# EAGLE design PCB 1e (EAGLE 9.3.1)
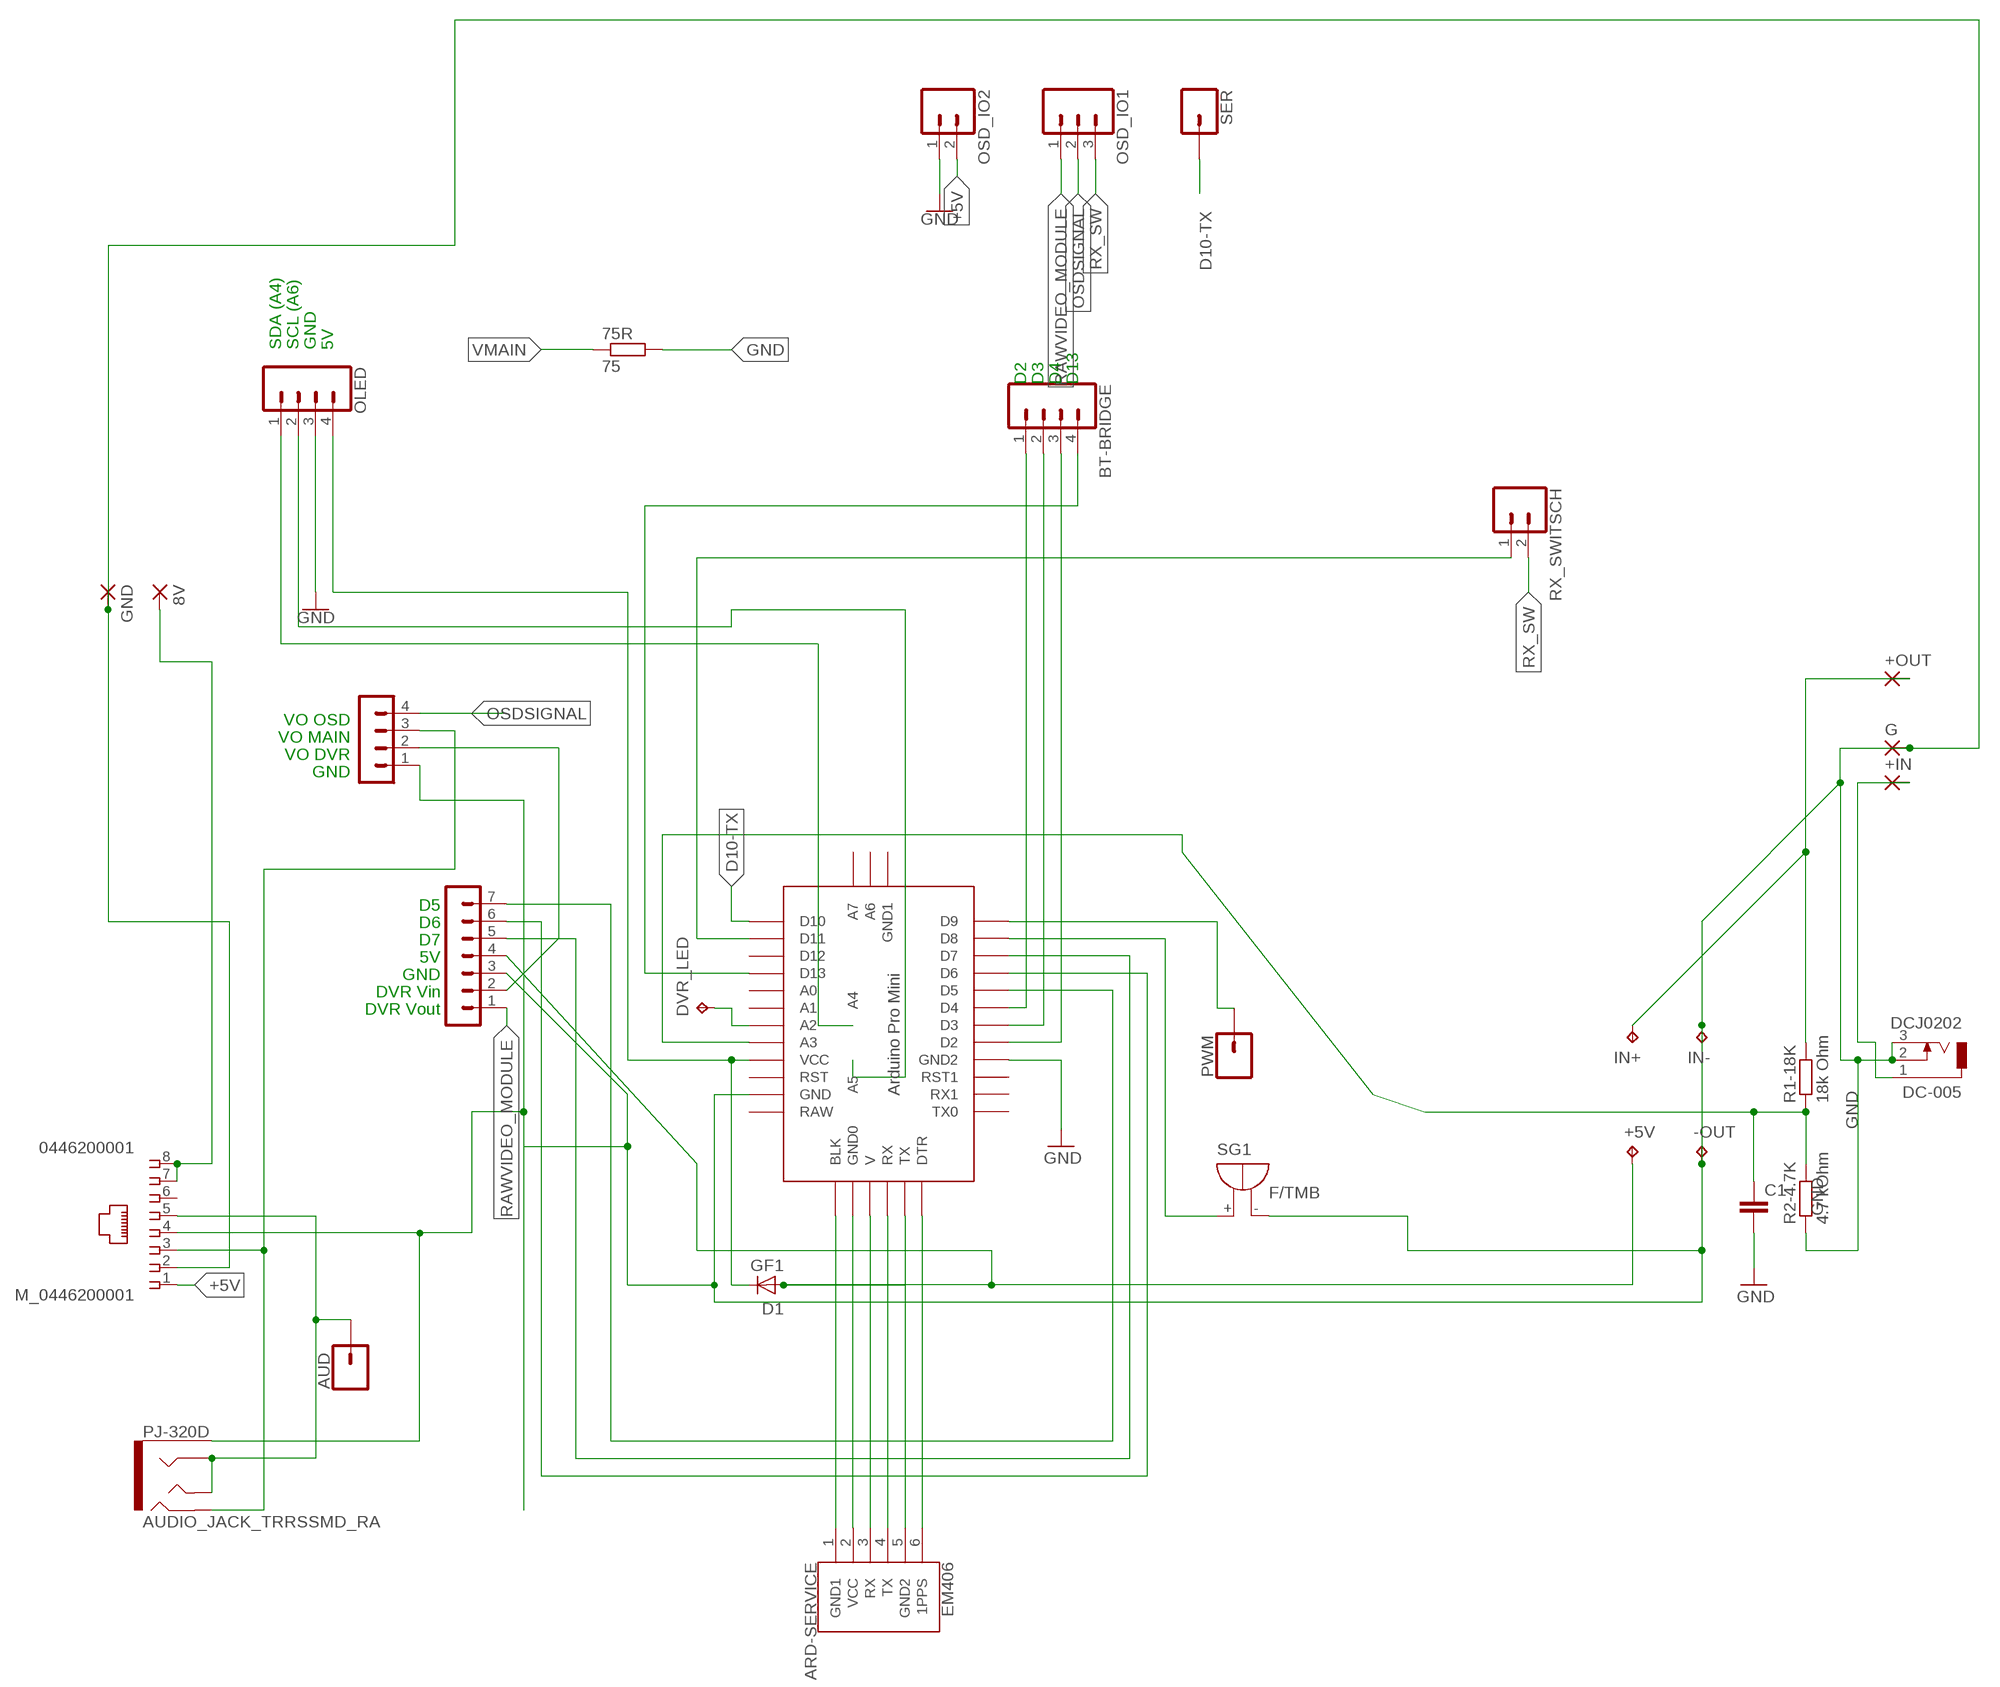
[diagram p0: schematic, sheet 1]

## Parts
8V  2,54/1,1  [2,54/1,1]
75R  75  R-EU_R0603  [R0603]
+5V  TPTP20SQ  [TP20SQ]
+IN  2,54/1,1  [2,54/1,1]
+OUT  2,54/1,1  [2,54/1,1]
-OUT  TPTP20SQ  [TP20SQ]
ARD-SERVICE  EM406  [1X06-1MM]
AUD  CONN_01  [1X01]
BT-BRIDGE  CONN_04  [1X04]
C1  C-EUC1206K  [C1206K]
D1  GF1  [SMA-DO214AC]
DC-005  DCJ0202  [DCJ0202]
DVR_LED  TPTP20SQ  [TP20SQ]
G  2,54/1,1  [2,54/1,1]
GND  2,54/1,1  [2,54/1,1]
IN+  TPTP20SQ  [TP20SQ]
IN-  TPTP20SQ  [TP20SQ]
M_0446200001  0446200001  [0446200001]
MODULE-IO  MA07-1  [MA07-1]
OLED  CONN_04  [1X04]
OSD_IO1  CONN_03  [1X03]
OSD_IO2  CONN_02  [1X02]
PJ-320D  AUDIO_JACK_TRRSSMD_RA  [AUDIO_JACK_3.5MM_TRRS_SMD_RA]
PWM  CONN_01  [1X01]
R1-18K  18k Ohm  R-EU_M1206  [M1206]
R2-4.7K  4.7 kOhm  R-EU_M1206  [M1206]
RX_SWITSCH  CONN_02  [1X02]
SER  CONN_01  [1X01]
SG1  F/TMB  [F/TMB]
U$1  ABK-PRO-MINI  [ABK-PRO-MINI]
V-IO  MA04-1  [MA04-1]

## Nets
5VPROTECTED: D1.K(C) OLED.4 U$1.VCC
8V: 8V.1(P) M_0446200001.7 M_0446200001.8
+: +IN.1(P) DC-005.1
+5V: +5V.TP D1.A M_0446200001.1 MODULE-IO.4 OSD_IO2.2
AUDIO [thin]: AUD.1 M_0446200001.5 PJ-320D.RING1 PJ-320D.TIP
BUTTON1 [thin]: BT-BRIDGE.3 U$1.D2
BUTTON2 [thin]: BT-BRIDGE.2 U$1.D3
BUTTON3 [thin]: BT-BRIDGE.1 U$1.D4
BUZZER [thin]: SG1.+ U$1.D8
D5 [thin]: MODULE-IO.7 U$1.D5
D6 [thin]: MODULE-IO.6 U$1.D6
D7 [thin]: MODULE-IO.5 U$1.D7
D9PWM [thin]: PWM.1 U$1.D9
D10-TX [thin]: SER.1 U$1.D10
D11-RX [thin]: RX_SWITSCH.1 U$1.D11
DVRVIDEO-IN [medium]: MODULE-IO.2 V-IO.2
GND [d_cl]: 75R.2 -OUT.TP C1.2 DC-005.2 DC-005.3 G.1(P) GND.1(P) IN-.TP M_0446200001.2 M_0446200001.4 MODULE-IO.3 OLED.3 OSD_IO2.1 PJ-320D.EARTH R2-4.7K.1 SG1.- U$1.GND U$1.GND1(GND2) V-IO.1
LED [thin]: BT-BRIDGE.4 U$1.D13
N$1 [thin]: DVR_LED.TP U$1.A1(A2)
N$16 [thin]: ARD-SERVICE.1(GND1) U$1.BLK
N$18 [thin]: ARD-SERVICE.2(VCC) U$1.G(GND0)
N$19 [thin]: ARD-SERVICE.3(RX) U$1.5V(V)
N$21 [thin]: ARD-SERVICE.5(GND2) U$1.TX01(TX)
N$22 [thin]: ARD-SERVICE.6(1PPS) U$1.DTR
OSDSIGNAL [medium]: OSD_IO1.2 V-IO.4
RAWVIDEO_MODULE [medium]: MODULE-IO.1 OSD_IO1.1
RX_SW [thin]: OSD_IO1.3 RX_SWITSCH.2
SCL [thin]: OLED.2 U$1.A5
SDA [thin]: OLED.1 U$1.A4
V [thin]: ARD-SERVICE.4(TX) U$1.RX01(RX)
VCC: +OUT.1(P) IN+.TP R1-18K.2
VMAIN [medium]: 75R.1 M_0446200001.3 PJ-320D.RING2 V-IO.3
VSENS: C1.1 R1-18K.1 R2-4.7K.2 U$1.A0(A3)
Unconnected: M_0446200001.6 U$1.A2(A1) U$1.A3(A0) U$1.A6 U$1.A7 U$1.D12 U$1.GND4(GND1) U$1.RAW U$1.RST U$1.RST1 U$1.RX1 U$1.TX0

## Notes on the sheet
- SDA (A4) | SCL (A6) | GND | 5V
- D2 | D3 | D4 | D13
- VO OSD
- VO MAIN
- VO DVR
- GND
- D5
- D6
- D7
- 5V
- GND
- DVR Vin
- DVR Vout

## Library data of the parts
8V +IN +OUT G GND = wirepad:2,54/1,1: THROUGH-HOLE PAD
75R = resistor:R-EU_: RESISTOR, European symbol
+5V -OUT DVR_LED IN+ IN- = testpad:TP: Test pad
ARD-SERVICE = SparkFun-Connectors:EM406: EM406 GPS Connector Here is a six pin vertical 1.0mm pitch connector. It is useful if you need something very tiny as a connection. These are not the standard JST type connectors we use on most of our boards, but are actually the much smaller JST-SH type. Here is the connector we sell at SparkFun: JST SH Vertical 6-Pin Connector - SMD <https://www.sparkfun.com/products/579> (GPS-00579) Datasheet <http://www.sparkfun.com/datasheets/GPS/EM406-SMDConnector-eSH.pdf> It was used on these SparkFun products: SparkFun GPS Breakout <https://www.sparkfun.com/products/11818> (BOB-11818) SparkFun Weather Shield <https://www.sparkfun.com/products/12081> (DEV-12081) And many, many other GPS related products.; PROD_ID: CONN-08249; SF_ID: GPS-00579
AUD PWM SER = SparkFun-Connectors:CONN_01: Single connection point. Often used as Generic Header-pin footprint for 0.1 inch spaced/style header connections On any of the 0.1 inch spaced packages, you can populate with these: Break Away Headers - Straight <https://www.sparkfun.com/products/116> (PRT-00116) Break Away Male Headers - Right Angle <https://www.sparkfun.com/products/553> (PRT-00553) Female Headers <https://www.sparkfun.com/products/115> (PRT-00115) Break Away Headers - Machine Pin <https://www.sparkfun.com/products/117> (PRT-00117) Break Away Female Headers - Swiss Machine Pin <https://www.sparkfun.com/products/743> (PRT-00743) This device is also useful as a general connection point to wire up your design to another part of your project. Our various solder wires solder well into these plated through hole pads. Hook-Up Wire - Assortment (Stranded, 22 AWG) <https://www.sparkfun.com/products/11375> (PRT-11375) Hook-Up Wire - Assortment (Solid Core, 22 AWG) <https://www.sparkfun.com/products/11367> (PRT-11367) View the entire wire category on our website here <https://www.sparkfun.com/categories/141> Special notes: SMTSO-256-ET is a "flush mount" nut for a 4-40 screw. We mostly use this on specialty testbeds; it is a nice way to connect hardware to your PCB at an adjustable hieght. Also note, the SNAP packages are for using a snappable style connector. We sell a baggie of snaps and they are also used on two LilyPad designs: Snap Assortment - 30 pack (male and female) <https://www.sparkfun.com/products/11347> (DEV-11347) LilyPad Arduino SimpleSnap <https://www.sparkfun.com/products/10941> (DEV-10941) LilyPad SimpleSnap Protoboard <https://www.sparkfun.com/products/10940> (DEV-10940)
BT-BRIDGE OLED = SparkFun-Connectors:CONN_04: Multi connection point. Often used as Generic Header-pin footprint for 0.1 inch spaced/style header connections On any of the 0.1 inch spaced packages, you can populate with these: Break Away Headers - Straight <https://www.sparkfun.com/products/116> (PRT-00116) Break Away Male Headers - Right Angle <https://www.sparkfun.com/products/553> (PRT-00553) Female Headers <https://www.sparkfun.com/products/115> (PRT-00115) Break Away Headers - Machine Pin <https://www.sparkfun.com/products/117> (PRT-00117) Break Away Female Headers - Swiss Machine Pin <https://www.sparkfun.com/products/743> (PRT-00743) For SCREWTERMINALS and SPRING TERMINALS visit here: Screw Terimnals on SparkFun.com <https://www.sparkfun.com/search/results?term=Screw+Terminals> (5mm/3.5mm/2.54mm spacing) This device is also useful as a general connection point to wire up your design to another part of your project. Our various solder wires solder well into these plated through hole pads. Hook-Up Wire - Assortment (Stranded, 22 AWG) <https://www.sparkfun.com/products/11375> (PRT-11375) Hook-Up Wire - Assortment (Solid Core, 22 AWG) <https://www.sparkfun.com/products/11367> (PRT-11367) View the entire wire category on our website here <https://www.sparkfun.com/categories/141> Special notes: Molex polarized connector foot print use with SKU : PRT-08231 with associated crimp pins and housings. 1MM SMD Version SKU: PRT-10208; PROD_ID: CONN-09696
C1 = rcl:C-EU: CAPACITOR, European symbol; SPICEPREFIX: C
D1 = diode:GF1: DIODE
DC-005 = con-jack:DCJ0202: DC POWER JACK Source: DCJ0202.pdf; OC_FARNELL: unknown; OC_NEWARK: unknown
M_0446200001 = con-molex:0446200001: RJ-45 INVERTED MODULAR JACK ASSEMBLY WITH RJ-11 KEEPOUT FEATURE Source: Data sheet <http://www.farnell.com/datasheets/73207.pdf>; MF: MOLEX; OC_FARNELL: unknown
MODULE-IO = con-lstb:MA07-1: PIN HEADER; OC_FARNELL: unknown; OC_NEWARK: unknown
OSD_IO1 = SparkFun-Connectors:CONN_03: Multi connection point. Often used as Generic Header-pin footprint for 0.1 inch spaced/style header connections On any of the 0.1 inch spaced packages, you can populate with these: Break Away Headers - Straight <https://www.sparkfun.com/products/116> (PRT-00116) Break Away Male Headers - Right Angle <https://www.sparkfun.com/products/553> (PRT-00553) Female Headers <https://www.sparkfun.com/products/115> (PRT-00115) Break Away Headers - Machine Pin <https://www.sparkfun.com/products/117> (PRT-00117) Break Away Female Headers - Swiss Machine Pin <https://www.sparkfun.com/products/743> (PRT-00743) Stackable Header - 3 Pin (Female, 0.1") <https://www.sparkfun.com/products/13875> (PRT-13875) For SCREWTERMINALS and SPRING TERMINALS visit here: Screw Terimnals on SparkFun.com <https://www.sparkfun.com/search/results?term=Screw+Terminals> (5mm/3.5mm/2.54mm spacing) This device is also useful as a general connection point to wire up your design to another part of your project. Our various solder wires solder well into these plated through hole pads. Hook-Up Wire - Assortment (Stranded, 22 AWG) <https://www.sparkfun.com/products/11375> (PRT-11375) Hook-Up Wire - Assortment (Solid Core, 22 AWG) <https://www.sparkfun.com/products/11367> (PRT-11367) View the entire wire category on our website here <https://www.sparkfun.com/categories/141> Special notes: Molex polarized connector foot print use with SKU : PRT-08232 with associated crimp pins and housings.
OSD_IO2 RX_SWITSCH = SparkFun-Connectors:CONN_02: Multi connection point. Often used as Generic Header-pin footprint for 0.1 inch spaced/style header connections On any of the 0.1 inch spaced packages, you can populate with these: Break Away Headers - Straight <https://www.sparkfun.com/products/116> (PRT-00116) Break Away Male Headers - Right Angle <https://www.sparkfun.com/products/553> (PRT-00553) Female Headers <https://www.sparkfun.com/products/115> (PRT-00115) Break Away Headers - Machine Pin <https://www.sparkfun.com/products/117> (PRT-00117) Break Away Female Headers - Swiss Machine Pin <https://www.sparkfun.com/products/743> (PRT-00743) For SCREWTERMINALS and SPRING TERMINALS visit here: Screw Terimnals on SparkFun.com <https://www.sparkfun.com/search/results?term=Screw+Terminals> (5mm/3.5mm/2.54mm spacing) This device is also useful as a general connection point to wire up your design to another part of your project. Our various solder wires solder well into these plated through hole pads. Hook-Up Wire - Assortment (Stranded, 22 AWG) <https://www.sparkfun.com/products/11375> (PRT-11375) Hook-Up Wire - Assortment (Solid Core, 22 AWG) <https://www.sparkfun.com/products/11367> (PRT-11367) View the entire wire category on our website here <https://www.sparkfun.com/categories/141> Special notes: Molex polarized connector foot print use with: PRT-08233 with associated crimp pins and housings. 2.54_SCREWTERM for use with PRT-10571. 3.5mm Screw Terminal footprints for PRT-08084 5mm Screw Terminal footprints for use with PRT-08432
PJ-320D = SparkFun-Connectors:AUDIO_JACK_TRRS: Audio Jack - 3.5mm TRRS (SMD) This is a 3.5mm TRRS SMD audio jack. TRRS connectors are the audio-style connectors that you see on some phones, MP3 players and development boards. TRRS stands for “tip, ring, ring, sleeve,” which reflects that this has three conductors and a ground. SparkFun Products: Audio Jack <https://www.sparkfun.com/products/12639> mbed Starter Kit <https://www.sparkfun.com/products/12968> SparkFun TRRS 3.5mm Jack Breakout <https://www.sparkfun.com/products/11570>; PROD_ID: CONN-10676; SF_ID: PRT-12639
R1-18K R2-4.7K = rcl:R-EU_: RESISTOR, European symbol; SPICEPREFIX: R
SG1 = buzzer:F/TMB: BUZZER Source: Buerklin; OC_FARNELL: unknown; OC_NEWARK: unknown
U$1 = Arduino-clone:ABK-PRO-MINI: ABK Pro-Mini Arduino Clone
V-IO = con-lstb:MA04-1: PIN HEADER; OC_FARNELL: unknown; OC_NEWARK: unknown

## Net classes
0 default: width 0.762 mm, drill 0.508 mm, clearance 0.508 mm
1 thin: width 0.3 mm, drill 0.3 mm, clearance 0.3 mm
2 medium: width 0.5 mm, drill 0.4 mm, clearance 0.3 mm
3 d_cl: width 0.762 mm, drill 0.508 mm, clearance 0.3 mm

## Board
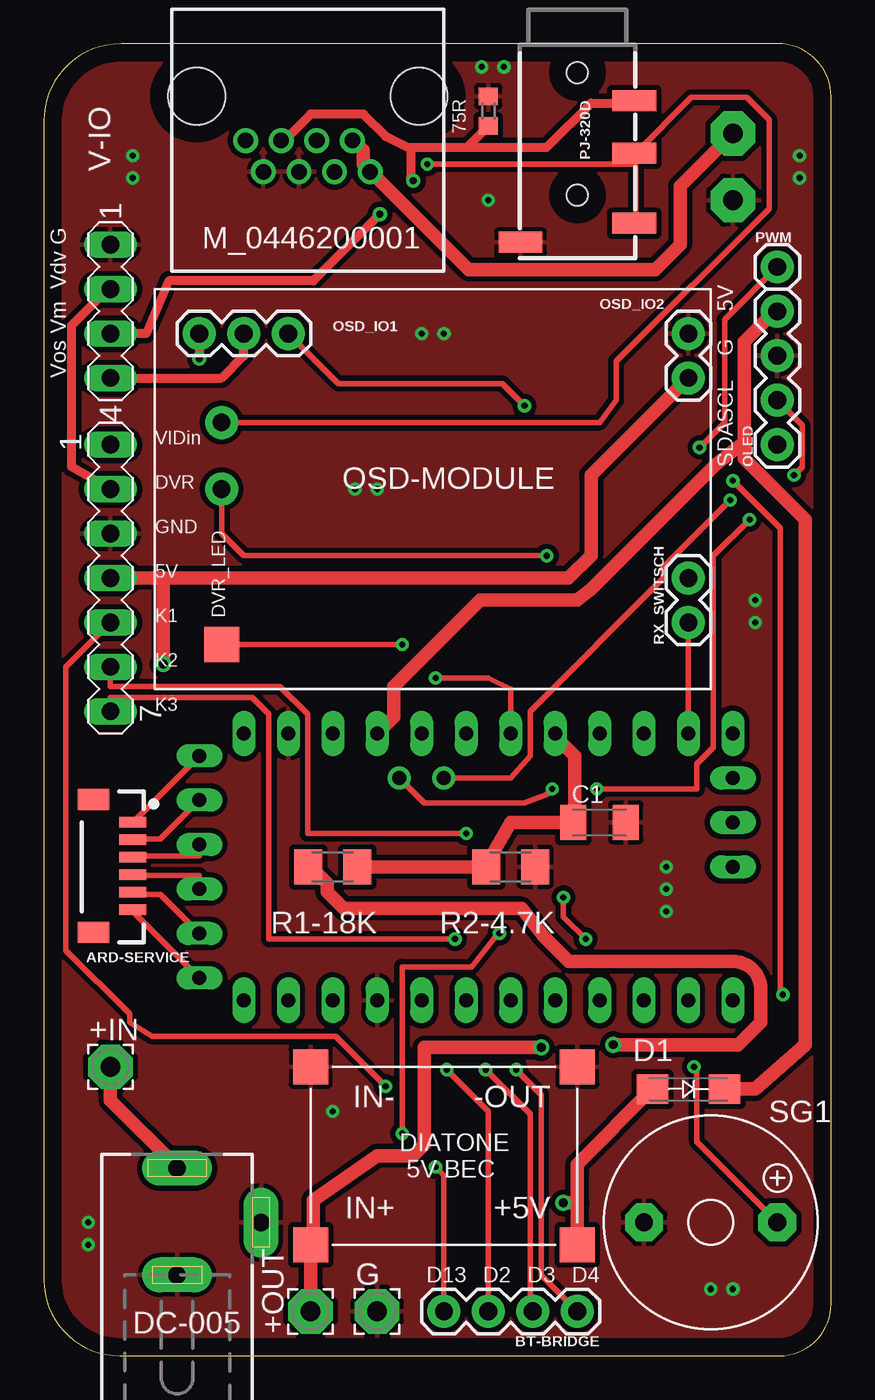
[diagram p1: board, top side]
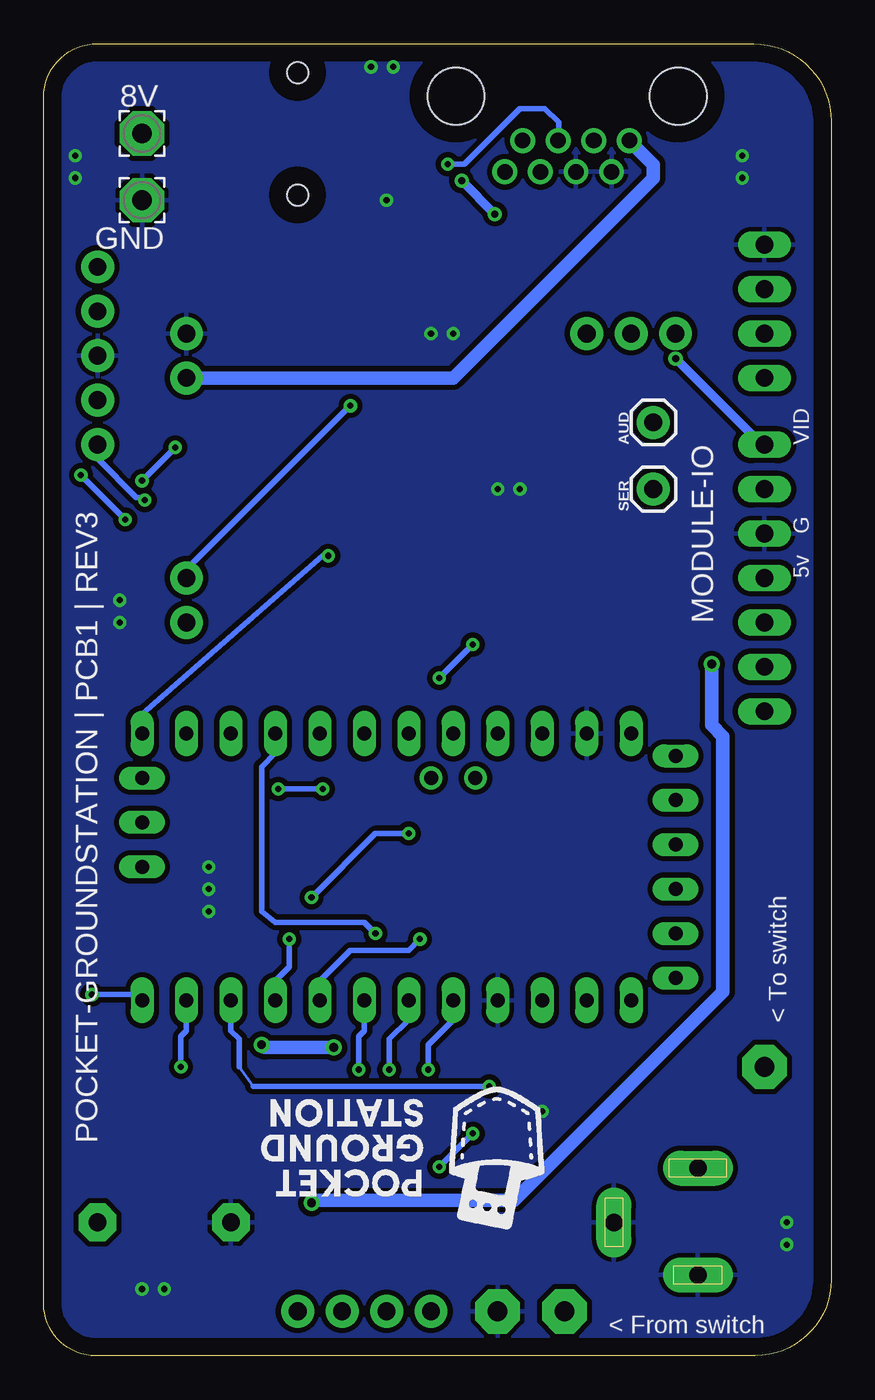
[diagram p2: board, bottom side, seen from below]

Size 44.98 x 74.98 mm. Coordinates in mm from the lower left corner, seen from the top.
Outline: 41.94,74.98 4.42,74.98 arc90 0,70.56 0,4.34 arc90 4.34,0 42.02,0 arc90 44.98,2.97 44.98,71.94 arc90 41.94,74.98
Copper layers (1*16): Top 0.035mm / dielectric 1.5mm / Bottom 0.035mm
Design rules "PCB Albert *": minimum track width 0.15mm, minimum drill 0.35mm, track to track 0.205mm, track to pad 0.205mm, pad to pad 0.205mm, via to via 0.205mm, smd to smd 6mil, copper to edge 40mil, drill to drill 6mil, minimum pad ring 10mil, minimum via ring 8mil, stop-mask expansion 4mil, vias tented up to drill 2mm, thermal gap 10mil

### Footprints (pad centres in the part's own frame; a part is rotated, then mirrored left to right if it is on the bottom)
2,54/1,1 = drill 1.118 pad 2.54 octagon: 1 0,0
R0603 = smd 1 x 1.1: 1 -0.85,0; 2 0.85,0
TP20SQ = smd 2 x 2: TP 0,0
1X06-1MM = smd 0.6 x 1.55: 1 -2.54,1.27; 2 -1.54,1.27; 3 -0.54,1.27; 4 0.46,1.27; 5 1.46,1.27; 6 2.46,1.27 | smd 1.2 x 1.8: P$1 -3.84,-0.955; P$2 3.76,-0.955
1X01 = drill 1.016 pad 1.88: 1 0,0
1X04 = drill 1.016 pad 1.88: 1 0,0; 2 2.54,0; 3 5.08,0; 4 7.62,0
C1206K = smd 1.5 x 2: 1 -1.5,0; 2 1.5,0
SMA-DO214AC = smd 1.8 x 1.7: A -2.05,0; K 2.05,0
DCJ0202 = drill 1 pad 2 long: 1 0,3.1; 2 4.8,0; 3 0,-3
0446200001 = drill 0.889 pad 1.422: 1 3.556,2.54; 2 2.54,4.318; 3 1.524,2.54; 4 0.508,4.318; 5 -0.508,2.54; 6 -1.524,4.318; 7 -2.54,2.54; 8 -3.556,4.318 | hole 3.251: 6.35,0; -6.35,0
MA07-1 = drill 1.016 long: 1 -7.62,0; 2 -5.08,0; 3 -2.54,0; 4 0,0; 5 2.54,0; 6 5.08,0; 7 7.62,0
1X03 = drill 1.016 pad 1.88: 1 0,0; 2 2.54,0; 3 5.08,0
1X02 = drill 1.016 pad 1.88: 1 0,0; 2 2.54,0
AUDIO_JACK_3.5MM_TRRS_SMD_RA = smd 1.2 x 2.5: EARTH 11.3,-3.25; RING1 6.2,3.25; RING2 3.2,3.25; TIP 10.2,3.25 | hole 1.2: 1.6,0; 8.6,0
M1206 = smd 1.6 x 2: 1 -1.4,0; 2 1.4,0
F/TMB = drill 1.016 pad 2.159 octagon: + 3.81,0; - -3.81,0
ABK-PRO-MINI = drill 0.8 long: 5V 3.81,8.89; A0 10.16,-11.43; A1 10.16,-8.89; A2 10.16,-6.35; A3 10.16,-3.81; A6 5.08,-21.59; A7 7.62,-21.59; BLK 8.89,8.89; D2 -5.08,-3.81; D3 -5.08,-6.35; D4 -5.08,-8.89; D5 -5.08,-11.43; D6 -5.08,-13.97; D7 -5.08,-16.51; D8 -5.08,-19.05; D9 -5.08,-21.59; D10 10.16,-21.59; D11 10.16,-19.05; D12 10.16,-16.51; D13 10.16,-13.97; DTR -3.81,8.89; G 6.35,8.89; GND 10.16,3.81; GND1 -5.08,-1.27; GND4 2.54,-21.59; RAW 10.16,6.35; RST 10.16,1.27; RST1 -5.08,1.27; RX01 1.27,8.89; RX1 -5.08,3.81; TX0 -5.08,6.35; TX01 -1.27,8.89; VCC 10.16,-1.27 | drill 0.8: A4 7.62,-5.08; A5 7.62,-2.54
MA04-1 = drill 1.016 long: 1 -3.81,0; 2 -1.27,0; 3 1.27,0; 4 3.81,0

### Placement (x,y rotation side)
8V  39.37,69.85 0 bottom
75R  25.4,71.12 90 top
+5V  30.48,6.35 0 top
+IN  3.81,16.51 270 top
+OUT  15.24,2.54 0 top
-OUT  30.48,16.51 180 top
ARD-SERVICE  3.81,27.94 270 top
AUD  10.16,53.34 90 bottom
BT-BRIDGE  30.48,2.54 180 top
C1  31.75,30.48 0 top
D1  36.83,15.24 0 top
DC-005  7.62,7.62 0 top
DVR_LED  10.16,40.64 270 top
G  19.05,2.54 0 top
GND  39.37,66.04 180 bottom
IN+  15.24,6.35 0 top
IN-  15.24,16.51 180 top
M_0446200001  15.09,71.98 180 top
MODULE-IO  3.81,44.45 270 top
OLED  41.91,52.07 90 top
OSD_IO1  8.89,58.42 0 top
OSD_IO2  36.83,58.42 270 top
PJ-320D  30.48,74.93 270 top
PWM  41.91,62.23 0 top
R1-18K  16.51,27.94 180 top
R2-4.7K  26.67,27.94 180 top
RX_SWITSCH  36.83,41.91 90 top
SER  10.16,49.53 90 bottom
SG1  38.1,7.62 0 top
U$1  17.78,25.4 90 top
V-IO  3.81,59.69 270 top

### Tracks (layer width: path | path; a pad name or v marks a point on that pad's centre or on a via)
5VPROTECTED
  Top 0.762: D1.K 40.64,15.24 43.5,17.78 43.5,47.78 40.01,51.28 40.01,52.23 | 40.01,52.23 40.01,57.94 41.75,59.69 OLED.4 | U$1.VCC 20,36.51 20,38.26 24.92,43.18 30.48,43.18 31.27,43.81 38.42,50.96 40.01,52.23
8V
  Top 0.762: M_0446200001.7 17.78,69.37 18.26,68.9 18.26,68.1 18.57,67.79 M_0446200001.8 18.89,67.47 24.29,62.07 34.92,62.07 36.35,63.5 36.35,66.83 8V.1
+
  Top 0.762: +IN.1 3.81,14.61 7.62,10.79 DC-005.1
+5V  (via drill 0.51)
  Top 0.762: +5V.TP 30.48,8.73 | 30.48,8.73 30.48,10.95 34.77,15.24 D1.A | 6.83,44.45 29.97,44.45 31.27,45.72 31.27,50.32 OSD_IO2.2 | 6.83,44.45 MODULE-IO.4 | v29.69,8.73 30.48,8.73 | 6.83,44.45 v6.83,39.53
  Bottom 0.762: v29.69,8.73 29.53,8.89 18.1,8.89 6.19,20.8 6.19,35.4 6.83,36.04 v6.83,39.53 | M_0446200001.1 10.16,68.07 10.16,67.31 21.59,55.88 OSD_IO2.2
AUDIO  (via drill 0.35)
  Top 0.3: 33.81,68.1 33.81,68.58 PJ-320D.RING1 33.81,68.74 36.99,71.91 40.16,71.91 41.43,70.64 41.43,65.56 32.7,56.83 32.7,54.61 31.75,53.34 AUD.1 | 33.81,68.1 33.81,64.77 PJ-320D.TIP | 33.81,68.1 v21.91,68.1
  Bottom 0.3: v21.91,68.1 20.95,68.1 17.78,71.28 16.35,71.28 15.56,70.48 15.56,69.53 M_0446200001.5
BUTTON1  (via drill 0.35)
  Top 0.3: v23.02,16.35 25.4,13.97 BT-BRIDGE.3
  Bottom 0.3: U$1.D2 21.59,19.21 23.02,17.78 v23.02,16.35
BUTTON2  (via drill 0.35)
  Top 0.3: v25.24,16.35 27.78,13.81 27.78,2.7 BT-BRIDGE.2
  Bottom 0.3: U$1.D3 24.13,19.21 25.24,18.1 v25.24,16.35
BUTTON3  (via drill 0.35)
  Top 0.3: v26.99,16.35 28.42,14.92 28.42,4.6 BT-BRIDGE.1
  Bottom 0.3: U$1.D4 26.67,18.57 26.99,18.26 v26.99,16.35
BUZZER  (via drill 0.35)
  Top 0.3: v37.15,16.51 37.31,16.35 37.31,12.22 SG1.+
  Bottom 0.3: U$1.D8 36.83,18.57 37.15,18.26 v37.15,16.51
D5  (via drill 0.35)
  Top 0.3: v23.5,23.81 12.86,23.81 12.86,36.67 11.91,37.62 3.81,37.62 MODULE-IO.7
  Bottom 0.3: U$1.D5 29.21,21.43 27.46,23.18 24.13,23.18 v23.5,23.81
D6  (via drill 0.35)
  Top 0.3: v30.96,23.81 29.69,25.08 v29.69,26.19 | v24.13,29.84 15.08,29.84 15.08,36.67 13.49,38.26 3.81,38.26 MODULE-IO.6
  Bottom 0.3: U$1.D6 31.75,21.43 30.96,22.23 v30.96,23.81 | v29.69,26.19 26.04,29.84 v24.13,29.84
D7  (via drill 0.35)
  Top 0.3: v19.53,15.4 16.67,18.26 6.19,18.26 4.92,19.05 4.92,19.53 1.27,23.18 1.27,39.37 MODULE-IO.5
  Bottom 0.152: 33.02,15.4 33.81,16.51
  Bottom 0.3: U$1.D7 34.29,18.57 33.81,18.1 33.81,16.51 | v19.53,15.4 33.02,15.4
D9PWM  (via drill 0.35)
  Top 0.3: v42.23,20.64 42.07,20.8 42.07,47.31 v39.37,50.01 | v37.47,51.91 38.89,53.34 38.89,59.21 PWM.1
  Bottom 0.3: U$1.D9 39.69,20.64 v42.23,20.64 | v37.47,51.91 v39.37,50.01
D10-TX  (via drill 0.35)
  Top 0.3: v28.73,45.72 11.43,45.72 10.16,46.99 SER.1
  Bottom 0.3: U$1.D10 39.37,36.67 29.05,45.72 v28.73,45.72
D11-RX
  Top 0.3: RX_SWITSCH.1 U$1.D11
DVRVIDEO-IN
  Top 0.5: V-IO.2 3.65,60.96 1.59,58.9 1.59,50.8 MODULE-IO.2
GND  (via drill 0.35)
  other vias: 35.56,27.94 35.56,26.67 35.56,25.4 39.37,3.81 38.1,3.81 2.54,6.35 2.54,7.62 17.78,49.53 19.05,49.53 16.51,13.97 21.59,58.42 22.86,58.42 5.08,68.58 5.08,67.31 25.02,73.66 25.4,66.04 43.18,67.31 43.18,68.58 40.64,43.18 40.64,41.91 26.29,73.66
  pour Bottom: -1.27,76.2 -1.27,-1.27 45.72,-1.27 45.72,76.2
  pour Top: -2.54,77.47 46.99,77.47 46.99,-2.54 -2.54,-2.54
LED  (via drill 0.35)
  Top 0.3: v26.04,24.13 25.72,23.81 24.45,22.23 20.48,22.23 v20.48,12.7 | v22.38,10.79 22.86,10.32 BT-BRIDGE.4
  Bottom 0.3: U$1.D13 31.75,34.45 32.54,33.66 32.54,25.4 31.75,24.77 26.67,24.77 v26.04,24.13 | v22.38,10.79 v20.48,12.7
N$1  (via drill 0.35)
  Top 0.3: v20.48,40.64 DVR_LED.TP | v22.38,38.73 25.4,38.73 26.67,38.1 U$1.A1
  Bottom 0.3: v22.38,38.73 v20.48,40.64
N$16
  Top 0.3: U$1.BLK ARD-SERVICE.1
N$18
  Top 0.3: U$1.G 6.67,29.53 5.08,29.53 ARD-SERVICE.2
N$19
  Top 0.3: U$1.5V 8.89,28.57 5.08,28.57 ARD-SERVICE.3
N$21
  Top 0.3: U$1.TX01 6.67,26.35 5.08,26.35 ARD-SERVICE.5
N$22
  Top 0.3: U$1.DTR 5.08,25.4 ARD-SERVICE.6
OSDSIGNAL
  Top 0.5: V-IO.4 10.16,55.88 11.43,57.15 OSD_IO1.2
RAWVIDEO_MODULE  (via drill 0.4)
  Top 0.5: OSD_IO1.1 v8.89,56.99
  Bottom 0.5: MODULE-IO.1 4.29,52.55 4.45,52.55 v8.89,56.99
RX_SW  (via drill 0.35)
  Top 0.3: OSD_IO1.3 16.83,55.56 26.19,55.56 v27.46,54.29
  Bottom 0.3: v27.46,54.29 36.83,44.93 RX_SWITSCH.2
SCL  (via drill 0.35)
  Top 0.3: U$1.A5 21.75,31.59 27.46,31.59 28.73,32.07 v29.05,32.38 | v31.59,32.38 37.31,32.38 37.31,33.81 38.26,34.77 38.26,45.72 v40.32,47.78 | v42.86,50.32 43.34,50.8 43.34,53.18 OLED.2
  Bottom 0.3: v31.59,32.38 v29.05,32.38 | v42.86,50.32 v40.32,47.78
SDA  (via drill 0.35)
  Top 0.3: U$1.A4 26.67,33.02 27.78,34.29 27.78,36.83 35.4,44.45 35.4,45.09 v39.21,48.9
  Bottom 0.3: v39.21,48.9 39.37,49.05 39.69,49.05 41.91,51.28 OLED.1
V
  Top 0.3: U$1.RX01 8.89,27.46 5.08,27.46 ARD-SERVICE.4
VCC  (via drill 0.51)
  Top 0.762: +OUT.1 IN+.TP 15.4,6.67 15.4,8.89 19.05,11.43 21.11,11.43 21.75,12.06 21.75,17.62 v28.42,17.62 | v32.54,17.78 39.69,17.78 40.96,19.05 40.96,20.95 arc90 39.37,22.54 30,22.54 28.57,23.97 27.3,25.56 17.14,25.56 16.19,26.51 16.19,26.99 15.24,27.94 R1-18K.2
  Bottom 0.762: v32.54,17.78 32.38,17.62 v28.42,17.62
VMAIN  (via drill 0.4)
  Top 0.152: 13.81,69.53 13.65,69.53
  Top 0.5: 20.95,69.06 20.8,69.06 19.53,69.69 18.26,70.96 15.24,70.96 13.81,69.53 | 20.95,69.06 24.13,69.06 24.19,69.06 | 24.19,69.06 28.73,69.06 31.27,71.6 33.66,71.6 PJ-320D.RING2 | 13.65,69.53 M_0446200001.3 | V-IO.3 5.85,58.42 7.14,61.44 15.4,61.44 v19.21,65.25 | v21.11,67.15 20.95,67.31 20.95,69.06 | 75R.1 24.19,69.06
  Bottom 0.5: v21.11,67.15 v19.21,65.25
VSENS
  Top 0.762: R1-18K.1 R2-4.7K.2 25.4,28.26 26.67,30.48 C1.1 30.32,30.8 30.32,34.29 29.21,35.4 U$1.A0

### Text on the board
tPlace: DIATONE / 5V BEC
tNames: G | Vdv | 5V | Vm | G | Vos | SCL | VIDin | OSD-MODULE | SDA | DVR | GND | 5V | K1 | K2 | K3 | D13 | D2 | D3 | D4
bNames: VID | POCKET-GROUNDSTATION | PCB1 | REV3 | G | 5v | < To switch | < From switch